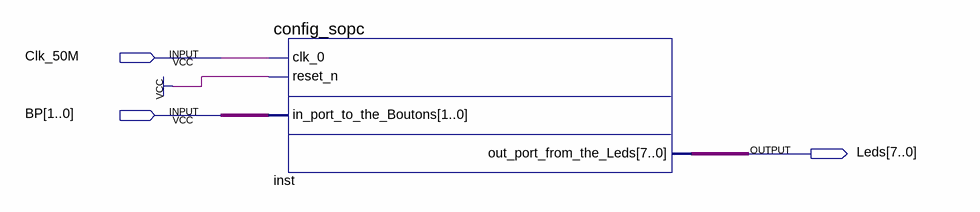
[diagram p0: schematic sheet]
// Quartus schematic Sopc_compteur.bdf as structural Verilog: 1 symbols, 3 pins
module Sopc_compteur (
  input  Clk_50M,
  input  [1:0] BP,
  output [7:0] Leds
);

  config_sopc inst (.clk_0(Clk_50M), .reset_n(1'b1), .in_port_to_the_Boutons(BP), .out_port_from_the_Leds(Leds));
endmodule
